# EasyEDA Pro project E-SportsV0.2-2_PCB.epro, board PCB1
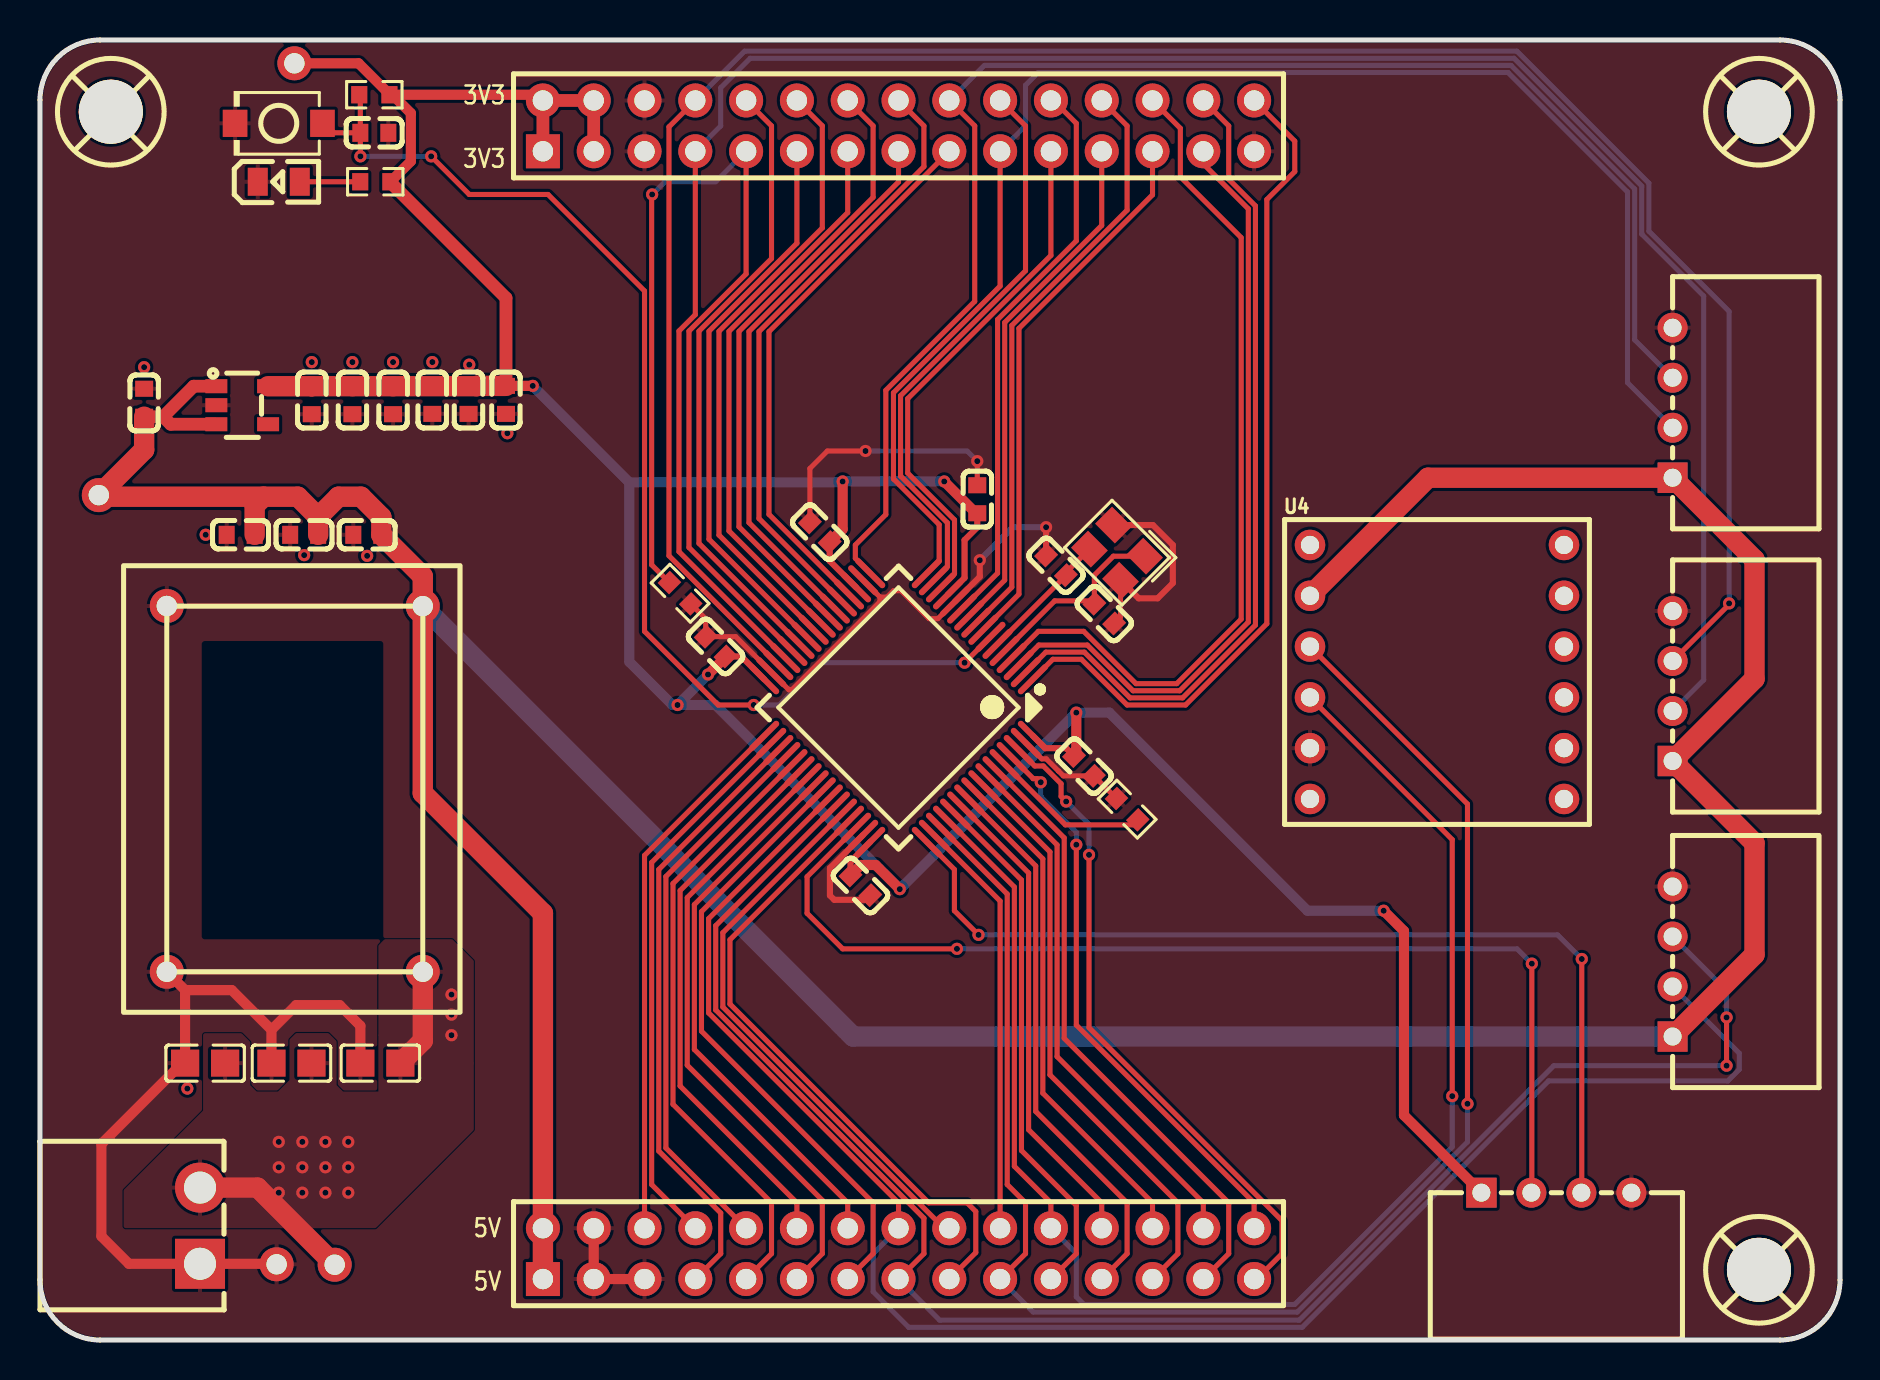
[diagram p3: board, top side]
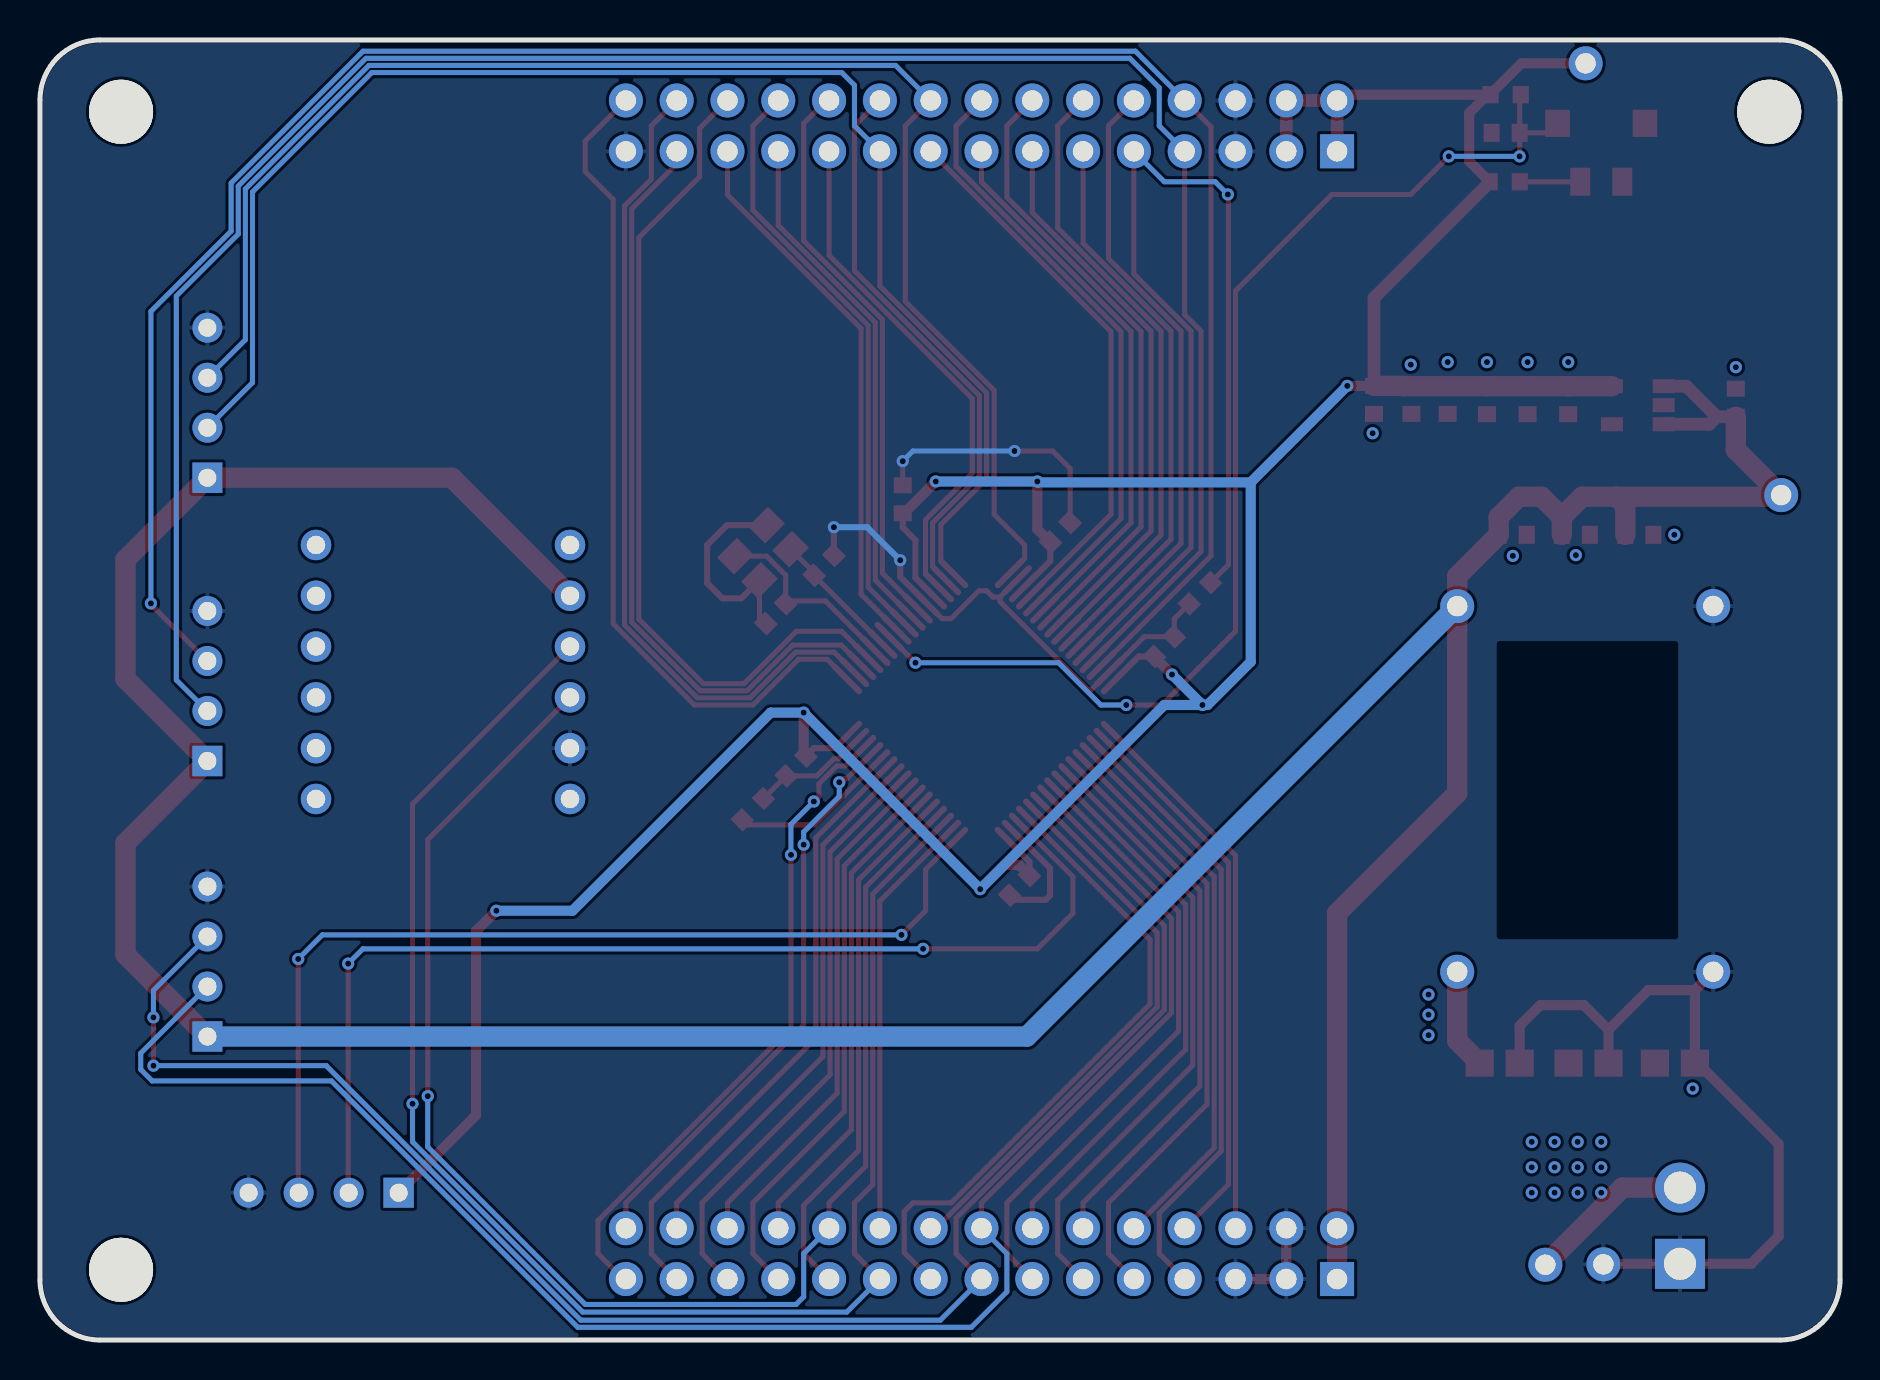
[diagram p4: board, bottom side, seen from below]

Outline 90 x 65 mm; copper layers: Top Layer, Bottom Layer. Coordinates in mm from the lower left corner of the outline.
Outline path: 0,62 0,3 arc(0.88,0.88) 3,0 87,0 arc(89.12,0.88) 90,3 90,62 arc(89.12,64.12) 87,65 3,65 arc(0.88,64.12) 0,62
Stack: Top Layer 0.035mm / Dielectric1 1.51mm FR4 er 4.5 / Bottom Layer 0.035mm

## Design rules (mm)
template: 自定义配置
spacing copperThickness1oz (default): track to track 0.102, other pairs 0.152 to 0.3
spacing copperThickness2oz: track to track 0.203, other pairs 0.152 to 0.3
track width copperThickness1oz (default): min 0.127, default 0.254, max 2.54
track width copperThickness2oz: min 0.203, default 0.254, max 2.54
differential pair differentialPair (default): width min 0.127, default 0.254, max 2.54; gap min 0.152, default 0.152
via viaSize (default): diameter min 0.5, default 0.61, max 10; hole min 0.3, default 0.305, max 6.3

## Placement (name value [footprint] x y rotation side)
C1  15pF  [C0603]  53.21 36.32 315 top
C2  15  [C0603]  50.8 38.73 135 top
C3  100nF  [C0603]  16.72 60.36 0 top
C4  100nF  [C0603]  41.02 22.73 135 top
C5  100nF  [C0603]  33.78 34.67 315 top
C6  100nF  [C0603]  52.2 28.7 135 top
C7  100nF  [C0603]  46.86 42.04 270 top
C8  100nF  [C0603]  38.99 40.39 315 top
C9  100nF  [C0603]  5.21 46.86 90 top
C10  100nF  [C0603]  13.59 46.99 270 top
C11  100nF  [C0603]  15.62 46.99 270 top
C12  100nF  [C0603]  17.65 46.99 270 top
C13  10uF  [C0805]  12.57 13.84 0 top
C14  10uF  [C0805]  17.02 13.84 0 top
C15  10uF  [C0805]  8.25 13.84 0 top
C16  100nF  [C0603]  19.62 47.01 90 top
C17  100nF  [C0603]  21.43 47.01 90 top
C18  100nF  [C0603]  23.3 47.01 90 top
C19  100nF  [C0603]  13.21 40.26 0 top
C20  100nF  [C0603]  16.36 40.26 0 top
C21  100nF  [C0603]  10.03 40.26 0 top
CN1  ZX-XH2.54-4PWZ  [CONN-TH_4P-P2.50_ZX-XH2.54-4PWZ]  81.63 18.92 90 top
CN2  ZX-XH2.54-4PWZ  [CONN-TH_4P-P2.50_ZX-XH2.54-4PWZ]  81.63 46.86 90 top
CN3  ZX-XH2.54-4PWZ  [CONN-TH_4P-P2.50_ZX-XH2.54-4PWZ]  81.63 32.7 90 top
CN4  DB2ERC-3.81-2P-GN  [CONN-TH_2P-P3.81_DB2ERC-3.81-2P]  8 5.72 270 top
CN5  ZX-XH2.54-4PWZ  [CONN-TH_4P-P2.50_ZX-XH2.54-4PWZ]  75.82 7.37 0 top
LED1  KT-0805W  [LED0805-R-RD]  11.94 57.91 0 top
R1  10K  [R0603]  16.72 62.26 0 top
R2  10K  [R0603]  32 37.34 315 top
R3  10K  [R0603]  54.36 26.54 135 top
R4  1K  [R0603]  16.76 57.91 180 top
SCREW1  -  [M3螺丝]  86.01 3.45 0 top
SCREW2  -  [M3螺丝]  86.01 61.35 0 top
SCREW3  -  [M3螺丝]  3.6 61.35 0 top
SW2  TS-1088-AR02016  [SW-SMD_L3.9-W3.0-P4.45]  11.94 60.83 180 top
U1  STM32F103RCT6TR  [LQFP-64_L10.0-W10.0-P0.50-LS12.0-BL]  42.93 31.62 135 top
U4  JY61P  [JY61P-直插]  69.85 33.4 0 top
U8  PM254-2-15-Z-8.5  [HDR-TH_30P-P2.54-V-F-R2-C15-S2.54-2]  42.93 4.32 0 top
U9  PM254-2-15-Z-8.5  [HDR-TH_30P-P2.54-V-F-R2-C15-S2.54-2]  42.93 60.71 0 top
U10  -  [DCDC]  12.44 27.56 90 top
U11  XC6210B332MR  [TSOT-23-5_L2.9-W1.6-P0.95-LS2.8-BR]  10.11 46.74 180 top
U12  -  [测试焊点]  11.83 3.78 0 top
U13  -  [测试焊点]  12.72 63.83 0 top
U14  -  [测试焊点]  14.73 3.76 0 top
U15  -  [测试焊点]  2.94 42.24 0 top
X1  8MHz  [CRYSTAL-SMD_4P-L3.2-W2.5-BL]  53.85 39.37 135 top

## Footprints (pads in the part's own frame, mm; a bottom-side part is the same pattern mirrored in y, then rotated)
C0603
  rect 0.8x0.9 smd: 1(-0.7,0) 2(0.7,0)
C0805
  rect 1.41x1.35 smd: 1(-1,0) 2(1,0)
CONN-TH_2P-P3.81_DB2ERC-3.81-2P
  rect 2.5x2.5 hole 1.6: 1(1.905,0)
  round 2.5 hole 1.6: 2(-1.905,0)
CONN-TH_4P-P2.50_ZX-XH2.54-4PWZ
  rect 1.524x1.5 hole 0.9: 1(-3.75,0)
  round 1.5 hole 0.9: 2(-1.25,0) 3(1.25,0) 4(3.75,0)
CRYSTAL-SMD_4P-L3.2-W2.5-BL
  rect 1.4x1.2 smd: 1(-1.1,-0.85) 2(1.1,-0.85) 3(1.1,0.85) 4(-1.1,0.85)
DCDC
  round 1.7 hole 1.02: 1(-9.144,6.096) 2(-9.144,-6.704) 3(9.144,6.096) 4(9.136,-6.704)
HDR-TH_30P-P2.54-V-F-R2-C15-S2.54-2
  rect 1.7x1.7 hole 1.02: 1(-17.78,-1.27)
  round 1.7 hole 1.02: 2(-17.78,1.27) 3(-15.24,-1.27) 4(-15.24,1.27) 5(-12.7,-1.27) 6(-12.7,1.27) 7(-10.16,-1.27) 8(-10.16,1.27) 9(-7.62,-1.27) 10(-7.62,1.27) 11(-5.08,-1.27) 12(-5.08,1.27) 13(-2.54,-1.27) 14(-2.54,1.27) 15(0,-1.27) 16(0,1.27) 17(2.54,-1.27) 18(2.54,1.27) 19(5.08,-1.27) 20(5.08,1.27) 21(7.62,-1.27) 22(7.62,1.27) 23(10.16,-1.27) 24(10.16,1.27) 25(12.7,-1.27) 26(12.7,1.27) 27(15.24,-1.27) 28(15.24,1.27) 29(17.78,-1.27) 30(17.78,1.27)
JY61P-直插
  round 1.524 hole 0.914: 1(-6.35,6.35) 2(-6.35,3.81) 3(-6.35,1.27) 4(-6.35,-1.27) 5(-6.35,-3.81) 6(-6.35,-6.35) 7(6.35,-6.35) 8(6.35,-3.81) 9(6.35,-1.27) 10(6.35,1.27) 11(6.35,3.81) 12(6.35,6.35)
LED0805-R-RD
  rect 1x1.399 smd: 1(1.05,0) 2(-1.05,0)
LQFP-64_L10.0-W10.0-P0.50-LS12.0-BL
  oval 0.3x2 smd: 1(-3.75,-5.75) 2(-3.25,-5.75) 3(-2.75,-5.75) 4(-2.25,-5.75) 5(-1.75,-5.75) 6(-1.25,-5.75) 7(-0.75,-5.75) 8(-0.25,-5.75) 9(0.25,-5.75) 10(0.75,-5.75) 11(1.25,-5.75) 12(1.75,-5.75) 13(2.25,-5.75) 14(2.75,-5.75) 15(3.25,-5.75) 16(3.75,-5.75) 33(3.75,5.75) 34(3.25,5.75) 35(2.75,5.75) 36(2.25,5.75) 37(1.75,5.75) 38(1.25,5.75) 39(0.75,5.75) 40(0.25,5.75) 41(-0.25,5.75) 42(-0.75,5.75) 43(-1.25,5.75) 44(-1.75,5.75) 45(-2.25,5.75) 46(-2.75,5.75) 47(-3.25,5.75) 48(-3.75,5.75)
  oval 2x0.3 smd: 17(5.75,-3.75) 18(5.75,-3.25) 19(5.75,-2.75) 20(5.75,-2.25) 21(5.75,-1.75) 22(5.75,-1.25) 23(5.75,-0.75) 24(5.75,-0.25) 25(5.75,0.25) 26(5.75,0.75) 27(5.75,1.25) 28(5.75,1.75) 29(5.75,2.25) 30(5.75,2.75) 31(5.75,3.25) 32(5.75,3.75) 49(-5.75,3.75) 50(-5.75,3.25) 51(-5.75,2.75) 52(-5.75,2.25) 53(-5.75,1.75) 54(-5.75,1.25) 55(-5.75,0.75) 56(-5.75,0.25) 57(-5.75,-0.25) 58(-5.75,-0.75) 59(-5.75,-1.25) 60(-5.75,-1.75) 61(-5.75,-2.25) 62(-5.75,-2.75) 63(-5.75,-3.25) 64(-5.75,-3.75)
M3螺丝
  round 3.2 hole 3.2: 1(-0.064,0.064)
R0603
  rect 0.806x0.864 smd: 1(-0.753,0) 2(0.753,0)
SW-SMD_L3.9-W3.0-P4.45
  rect 1.23x1.36 smd: 1(-2.185,0) 2(2.185,0)
TSOT-23-5_L2.9-W1.6-P0.95-LS2.8-BR
  rect 1.1x0.7 smd: 1(1.294,-0.951) 2(1.294,-0.001) 3(1.294,0.951) 4(-1.294,0.951) 5(-1.294,-0.949)
测试焊点
  round 1.7 hole 1.02: 1(0,0)

## Nets
As in the schematic.

Pads without a net: SCREW1 1; SCREW2 1; SCREW3 1; U4 1 6 7 8 9 10 11 12; U11 4

## Via types
v1: diameter 0.61, hole 0.305, Top Layer to Bottom Layer, 56 vias

## Routing (per net, layer and track width the routed paths; a pad name or vN(x,y) marks a point on that pad's centre or on a via; arc(x,y) is an arc through that point)
3V3: length 178.4
  Top Layer w0.305: C7.2 46.86,40.63 46.23,40 46.23,38.11 U1.13 ; C5.2 35.07,34.18 36.21,33.04 ; C6.2 51.31,29.59 50.26,29.59 U1.64 ; U1.19 39.48,38.95 C8.2 ; U1.48 40.53,23.92 C4.2
  Top Layer w0.508: v1(33.4,33.27) 34.28,34.15 C5.2 ; v1(51.82,31.37) 51.82,29.31 C6.2 ; U9.2 24.86,62.26 17.62,62.26 18.54,61.34 18.54,58.94 R4.1 ; v1(67.18,21.46) 68.2,20.45 68.2,11.24 CN5.1 ; C18.2 v1(24.64,47.71) ; C8.2 40.13,40.54 v1(40.13,42.93) ; R1.2 17.47,62.29 15.93,63.83 U13.1 ; C7.2 46.8,41.34 v1(45.21,42.93) ; C4.2 41.05,23.75 41.78,23.75 v1(42.99,22.54)
  Top Layer w0.635: C18.2 23.3,52.1 17.52,57.88 R4.1 ; U9.1 U9.2 U9.4 U9.3
  Top Layer w1.016: C18.2 21.83,47.71 21.82,47.69 C12.1 C11.1 C10.1 13.59,47.69 U11.5
  Bottom Layer w0.508: v1(45.21,42.93) v1(40.13,42.93) 40.09,42.88 29.46,42.88 ; 29.46,42.88 29.46,33.91 31.62,31.75 v1(31.88,31.75) 32,31.75 ; 29.46,42.88 v1(24.64,47.71) ; 32,31.75 33.78,31.75 v1(42.99,22.54) v1(51.82,31.37) 53.47,31.37 63.37,21.46 v1(67.18,21.46) ; 32,31.75 32,31.88 v1(33.4,33.27)
5V: length 198.6
  Top Layer w0.635: 6.16,46.16 7.69,47.69 U11.1 ; 6.16,46.16 6.53,45.79 U11.3 ; 6.16,46.16 C9.1
  Top Layer w1.016: 11.18,42.16 2.86,42.16 2.81,42.12 ; 11.18,42.16 12.89,42.16 13.91,41.15 ; 11.18,42.16 10.73,41.72 C21.2 ; U4.2 69.4,43.11 CN2.1 85.72,39.02 85.72,33.06 81.63,28.96 CN3.1 81.63,28.94 85.72,24.84 85.72,19.27 CN1.1 ; 13.91,41.15 14.92,42.16 16.05,42.16 17.06,41.15 C20.2 19.14,38.19 U10.4 19.14,27.34 25.15,21.34 U8.2 U8.1 ; 13.91,41.15 C19.2 ; U15.1 5.21,44.51 C9.1
  Bottom Layer w1.016: CN1.1 40.66,15.17 U10.4
12V: length 13.4
  Top Layer w1.016: C14.2 19.14,14.96 U10.2 ; U14.1 10.88,7.62 CN4.2
  vias: v1(11.94,9.91) v1(11.94,8.64) v1(11.94,7.37) v1(13.12,9.91) v1(13.12,8.64) v1(13.12,7.37) v1(14.27,9.91) v1(14.27,8.64) v1(14.27,7.37) v1(15.41,9.91) v1(15.41,8.64) v1(15.41,7.37) v1(20.57,17.27) v1(20.57,16.27) v1(20.57,15.24)
GND: length 107
  Top Layer w0.254: R2.2 33.29,36.06 C5.1 34.79,35.17 U1.31 37.44,32.51 37.59,32.51 42,36.92 42,37.15 ; R3.2 C6.1 51.17,28.21 50.93,28.45 50.92,28.45 50.31,29.06 50.09,29.06 U1.63 ; C8.1 38.49,43.57 39.37,44.45 v1(41.28,44.45) ; X1.4 54.03,36.14 C1.2 ; U1.12 44.9,36.07 44.45,36.07 43.05,37.47 42.67,37.47 42.35,37.15 42,37.15 ; 42,37.15 41.16,37.99 ; v1(46.86,43.94) 46.86,42.74
  Top Layer w0.305: 50.31,39.23 v1(50.31,40.64) ; X1.4 54.93,37.08 55.88,37.08 56.64,37.85 56.64,39.75 55.65,40.75 X1.2 ; U1.47 39.5,23.6 39.5,22.22 39.71,22.01 41.29,22.01 C4.1 ; v1(46.99,38.99) 46.99,38.16 U1.12
  Top Layer w0.508: U10.1 7.25,17.5 ; 7.25,17.5 C15.1 7.11,13.84 3.07,9.8 3.07,5.19 4.44,3.81 CN4.1 11.81,3.81 U12.1 ; 7.25,17.5 9.59,17.5 11.57,15.51 ; 11.57,15.51 12.81,16.74 14.99,16.74 16.02,15.71 C14.1 ; 11.57,15.51 C13.1 ; U8.4 U8.3 U8.5
  Bottom Layer w0.254: v1(41.28,44.45) 46.35,44.45 v1(46.86,43.94)
  Bottom Layer w0.305: v1(46.99,38.99) 48.64,40.64 v1(50.31,40.64)
(no net):
  vias: v1(5.21,48.64) v1(7.37,12.57) v1(8.28,40.26) v1(13.21,39.24) v1(13.59,48.89) v1(15.62,48.89) v1(16.36,39.21) v1(17.65,48.89) v1(19.62,48.9) v1(21.46,48.77) v1(23.37,45.34)
BOOT0: length 7.7
  Top Layer w0.254: 48.23,28.8 51.27,25.76 54.63,25.76
NRST: length 59.4
  Top Layer w0.254: v1(16.02,59.18) 16.02,59.19 C3.1 ; v1(35.69,31.75) 33.91,31.75 30.23,35.43 30.23,52.45 25.4,57.28 21.46,57.28 v1(19.56,59.18) ; SW2.1 14.22,60.83 14.7,60.36 C3.1 ; U1.7 v1(46.23,33.86) ; C3.1 16.02,62.21 R1.1
  Bottom Layer w0.254: v1(16.02,59.18) v1(19.56,59.18) ; v1(35.69,31.75) 36.96,31.75 39.07,33.86 v1(46.23,33.86)
PA0: length 26
  Top Layer w0.254: U1.14 45.73,38.31 45.73,41.01 43.38,43.35 43.38,47.07 50.55,54.23 U9.21
PA1: length 28.4
  Top Layer w0.254: U9.20 49.28,60.71 49.28,53.46 43.03,47.21 43.03,43.2 45.37,40.86 45.37,38.66 44.69,37.99
PA2: length 73.9
  Top Layer w0.254: U9.19 48.01,52.7 42.67,47.36 42.67,43.05 44.96,40.77 44.96,38.96 U1.16
  Bottom Layer w0.254: CN2.2 79.38,47.87 79.38,57.4 73.41,63.37 49.91,63.37 49.28,62.74 49.28,60.71 U9.19
PA3: length 74.7
  Top Layer w0.254: U1.17 40.77,39.09 40.77,39.75 42.29,41.28 42.29,47.48 46.74,51.93 46.74,60.71 U9.18
  Bottom Layer w0.254: U9.18 47.22,63.73 73.55,63.73 79.73,57.55 79.73,50.01 CN2.3
PA4: length 27.5
  Top Layer w0.254: U1.20 36.45,41.28 36.45,50.42 U9.17
PA5: length 30.7
  Top Layer w0.254: U9.16 44.2,60.71 44.2,58.67 35.95,50.42 35.95,41.08 U1.21
PA6: length 27.7
  Top Layer w0.254: U9.15 42.93,57.9 35.45,50.43 35.45,40.87 U1.22
PA7: length 30.9
  Top Layer w0.254: U9.14 41.66,60.71 41.66,57.14 34.95,50.43 34.95,40.66 U1.23
PA8: length 30.9
  Top Layer w0.254: U8.13 41.66,4.32 41.66,6.86 33.07,15.44 33.07,21.42 U1.41
PA9: length 86.5
  Top Layer w0.254: U8.16 42.93,6.86 33.43,16.35 33.43,21.07 39.39,27.03
  Bottom Layer w0.254: CN1.2 84.96,14.34 84.96,13.53 84.39,12.95 75.43,12.95 63.11,0.63 43.43,0.63 41.66,2.41 41.66,4.32 U8.16
PA10: length 86
  Top Layer w0.254: U1.43 33.79,20.72 33.79,16.5 44.2,6.09 44.2,4.32 U8.15 ; v1(84.33,13.72) v1(84.33,16.13)
  Bottom Layer w0.254: U8.15 44.98,0.99 62.96,0.99 75.69,13.72 v1(84.33,13.72) ; CN1.3 84.33,17.47 v1(84.33,16.13)
PA11: length 28
  Top Layer w0.254: U1.44 34.14,20.36 34.14,16.65 45.2,5.59 U8.18
PA12: length 32.1
  Top Layer w0.254: U1.45 34.5,20.01 34.5,16.8 44.44,6.86 46.35,6.86 46.79,6.42 46.79,4.37 U8.17
PA13: length 54
  Top Layer w0.254: v1(45.85,19.56) 40.13,19.56 38.35,21.34 38.35,23.16 U1.46 ; v1(74.59,18.82) 74.59,7.39 CN5.2
  Bottom Layer w0.254: v1(45.85,19.56) 73.85,19.56 v1(74.59,18.82)
PA14: length 48.1
  Top Layer w0.254: U1.49 45.72,23.53 45.72,21.46 v1(46.93,20.26) ; v1(77.09,19.05) 77.09,7.39 CN5.3
  Bottom Layer w0.254: v1(46.93,20.26) 75.88,20.26 v1(77.09,19.05)
PA15: length 21
  Top Layer w0.254: U8.20 48.01,21.95 U1.50
PB0: length 28.1
  Top Layer w0.254: U1.26 33.45,40.04 33.45,50.44 37.85,54.84 U9.11
PB1: length 31.3
  Top Layer w0.254: U9.10 36.58,60.71 36.58,54.07 32.95,50.44 32.95,39.83 U1.27
PB2: length 53.7
  Top Layer w0.254: U9.9 35.31,53.3 32.45,50.45 32.45,39.62 37.62,34.45 ; v1(30.61,57.28) 30.58,57.25 30.58,38.76 R2.1
  Bottom Layer w0.254: v1(30.61,57.28) 31.24,57.91 33.78,57.91 U9.9
PB3: length 27.8
  Top Layer w0.254: U8.23 54.36,4.32 54.36,6.86 49.79,11.43 49.79,23.7 46.46,27.03
PB4: length 25.4
  Top Layer w0.254: U8.26 55.63,6.86 50.14,12.34 50.14,24.05 U1.56
PB5: length 29.2
  Top Layer w0.254: U8.25 56.9,4.32 56.9,6.86 50.5,13.26 50.5,24.4 U1.57
PB6: length 26.9
  Top Layer w0.254: U8.28 58.17,6.86 50.85,14.17 50.85,24.76 U1.58
PB7: length 30.7
  Top Layer w0.254: 47.88,28.44 51.21,25.11 51.21,15.08 59.44,6.86 59.44,4.32 U8.27
PB8: length 28.7
  Top Layer w0.254: v1(50.04,27.89) 49.86,28.07 49.66,28.07 49.66,28.07 U1.61 ; U8.30 60.71,6.86 51.82,15.75 v1(51.82,24.77)
  Bottom Layer w0.254: v1(51.82,24.77) 51.82,25.4 50.04,27.18 v1(50.04,27.89)
PB9: length 32.8
  Top Layer w0.254: U8.29 60.83,3.05 62.1,4.32 62.1,5.96 52.45,15.62 v1(52.45,24.26) ; v1(51.31,26.92) 51.05,27.18 51.05,27.81 50.16,28.7 49.74,28.7 U1.62
  Bottom Layer w0.254: v1(51.31,26.92) 52.45,25.78 v1(52.45,24.26)
PB10: length 109.1
  Top Layer w0.254: U1.29 31.95,39.42 31.95,50.45 32.77,51.27 U9.7
  Bottom Layer w0.254: CN3.2 83.19,33.01 83.19,52.2 80.09,55.3 80.09,57.7 73.7,64.08 35.51,64.08 34.04,62.61 34.04,60.71 U9.7
PB11: length 109.2
  Top Layer w0.254: U1.30 31.45,39.21 31.45,60.66 U9.8 ; CN3.3 84.46,36.78 v1(84.46,36.83)
  Bottom Layer w0.254: U9.8 35.23,64.44 73.85,64.44 80.44,57.85 80.44,55.44 84.46,51.43 v1(84.46,36.83)
PB12: length 27.1
  Top Layer w0.254: U1.33 30.23,24.23 U8.6
PB13: length 27.6
  Top Layer w0.254: U8.8 30.58,7.77 30.58,23.88 U1.34
PB14: length 30.7
  Top Layer w0.254: U8.7 34.04,4.32 34.04,6.35 30.94,9.45 30.94,23.52 U1.35
PB15: length 27.7
  Top Layer w0.254: U8.10 31.29,9.6 31.29,23.17 U1.36
PC0: length 27.4
  Top Layer w0.254: U1.8 48.95,37.29 48.95,50.58 55.63,57.26 U9.25
PC1: length 29.8
  Top Layer w0.254: U9.24 54.36,60.71 54.36,56.49 48.59,50.73 48.59,37.64 U1.9
PC2: length 26
  Top Layer w0.254: U9.23 53.09,55.73 48.24,50.88 48.24,37.99 U1.10
PC3: length 28.4
  Top Layer w0.254: U9.22 50.67,61.98 51.82,60.83 51.82,54.96 47.88,51.02 47.88,38.34 U1.11
PC4: length 27.9
  Top Layer w0.254: U1.24 34.45,40.45 34.45,50.43 40.39,56.37 U9.13
PC5: length 31.1
  Top Layer w0.254: U1.25 33.95,40.25 33.95,50.44 39.12,55.6 39.12,60.71 U9.12
PC6: length 30.8
  Top Layer w0.254: 37.62,28.8 31.65,22.82 31.65,11.78 36.58,6.86 36.58,4.32 U8.9
PC7: length 27.7
  Top Layer w0.254: 37.98,28.44 32.01,22.47 32.01,12.7 37.85,6.86 U8.12
PC8: length 30.8
  Top Layer w0.254: U1.39 32.36,22.12 32.36,13.74 39.12,6.99 39.12,4.32 U8.11
PC9: length 27.8
  Top Layer w0.254: U8.14 40.39,6.86 32.72,14.53 32.72,21.77 U1.40
PC10: length 80.3
  Top Layer w0.254: U1.51 48.36,22.3 48.36,7.77 49.28,6.86 49.28,4.32 U8.19 ; v1(71.37,11.81) 71.37,26.8 63.5,34.67
  Bottom Layer w0.254: U8.19 49.66,1.4 62.87,1.4 71.37,9.91 71.37,11.68
PC11: length 74.1
  Top Layer w0.254: v1(70.61,12.19) 70.61,25.02 U4.4 ; U8.22 50.55,6.86 48.72,8.69 48.72,22.65 U1.52
  Bottom Layer w0.254: U8.22 51.82,4.32 51.82,2.16 52.2,1.78 62.74,1.78 70.61,9.65 v1(70.61,12.19)
PC12: length 26.3
  Top Layer w0.254: U1.53 49.07,23 49.07,9.47 51.82,6.73 51.82,4.32 U8.21
PC13: length 41.7
  Top Layer w0.254: U9.28 59.44,60.71 59.44,58.04 60.77,56.7 60.77,35.75 57.13,32.11 54.5,32.11 52.22,34.39 50.29,34.39 U1.2
PC14: length 38.7
  Top Layer w0.254: U9.27 58.17,58.81 60.42,56.56 60.42,35.9 56.98,32.46 54.65,32.46 52.37,34.75 49.94,34.75 U1.3
PC15: length 42.2
  Top Layer w0.254: U1.4 49.92,35.43 52.18,35.43 54.8,32.82 56.83,32.82 60.06,36.04 60.06,55.12 57.02,58.16 57.02,60.58 U9.26
PD0: length 9.9
  Top Layer w0.254: 55.23,39.19 53.67,39.19 52.72,38.24 C1.1 52.58,36.96 50.74,36.96 48.23,34.45
PD1: length 6.6
  Top Layer w0.254: U1.6 51.29,38.22 51.29,38.37 X1.3
PD2: length 24
  Top Layer w0.254: U8.24 53.09,6.86 49.43,10.51 49.43,23.35 U1.54
VBT: length 42.3
  Top Layer w0.254: 49.64,33.04 50.64,34.04 52.07,34.04 54.36,31.75 57.28,31.75 61.34,35.81 61.34,57.02 62.74,58.42 62.74,59.94 U9.30
$1N16607: length 3
  Top Layer w0.254: LED1.1 R4.2

## Copper pours and planes (outline as drawn; the poured copper is in the pictures)
12V on Top Layer: 21.59,13.84 21.59,18.92 20.57,19.94 17.27,19.94 17.02,19.69 17.02,15.24 18.42,13.84
12V on Top Layer: 8.25,11.43 4.28,7.45 4.28,5.69 16.74,5.69 21.59,10.54 21.59,13.84 20.19,15.24 17.02,15.24 17.02,12.32 15.11,12.32 14.73,12.7 14.73,14.9 14.38,15.25 12.83,15.25 12.57,14.99 12.57,12.95 11.94,12.32 10.8,12.32 10.41,12.7 10.41,14.86 10.03,15.24 8.25,15.24
GND on Top Layer: -1.14,67.31 97.54,67.31 97.54,-7.75 -1.14,-7.75
GND on Bottom Layer: -2.54,69.34 99.69,69.34 99.69,-9.78 -2.54,-9.78

## Text on the board
Top Silkscreen Layer: 3V3 | 5V
